# Altium schematic sheet 02_8MPLUS_PMIC.SchDoc: 8MPLUS_PMIC
size 420 x 297 mm; Author: Lukas Henkel; DocumentNumber: 2; SheetNumber: 2; SheetTotal: 16; DocSize: A3
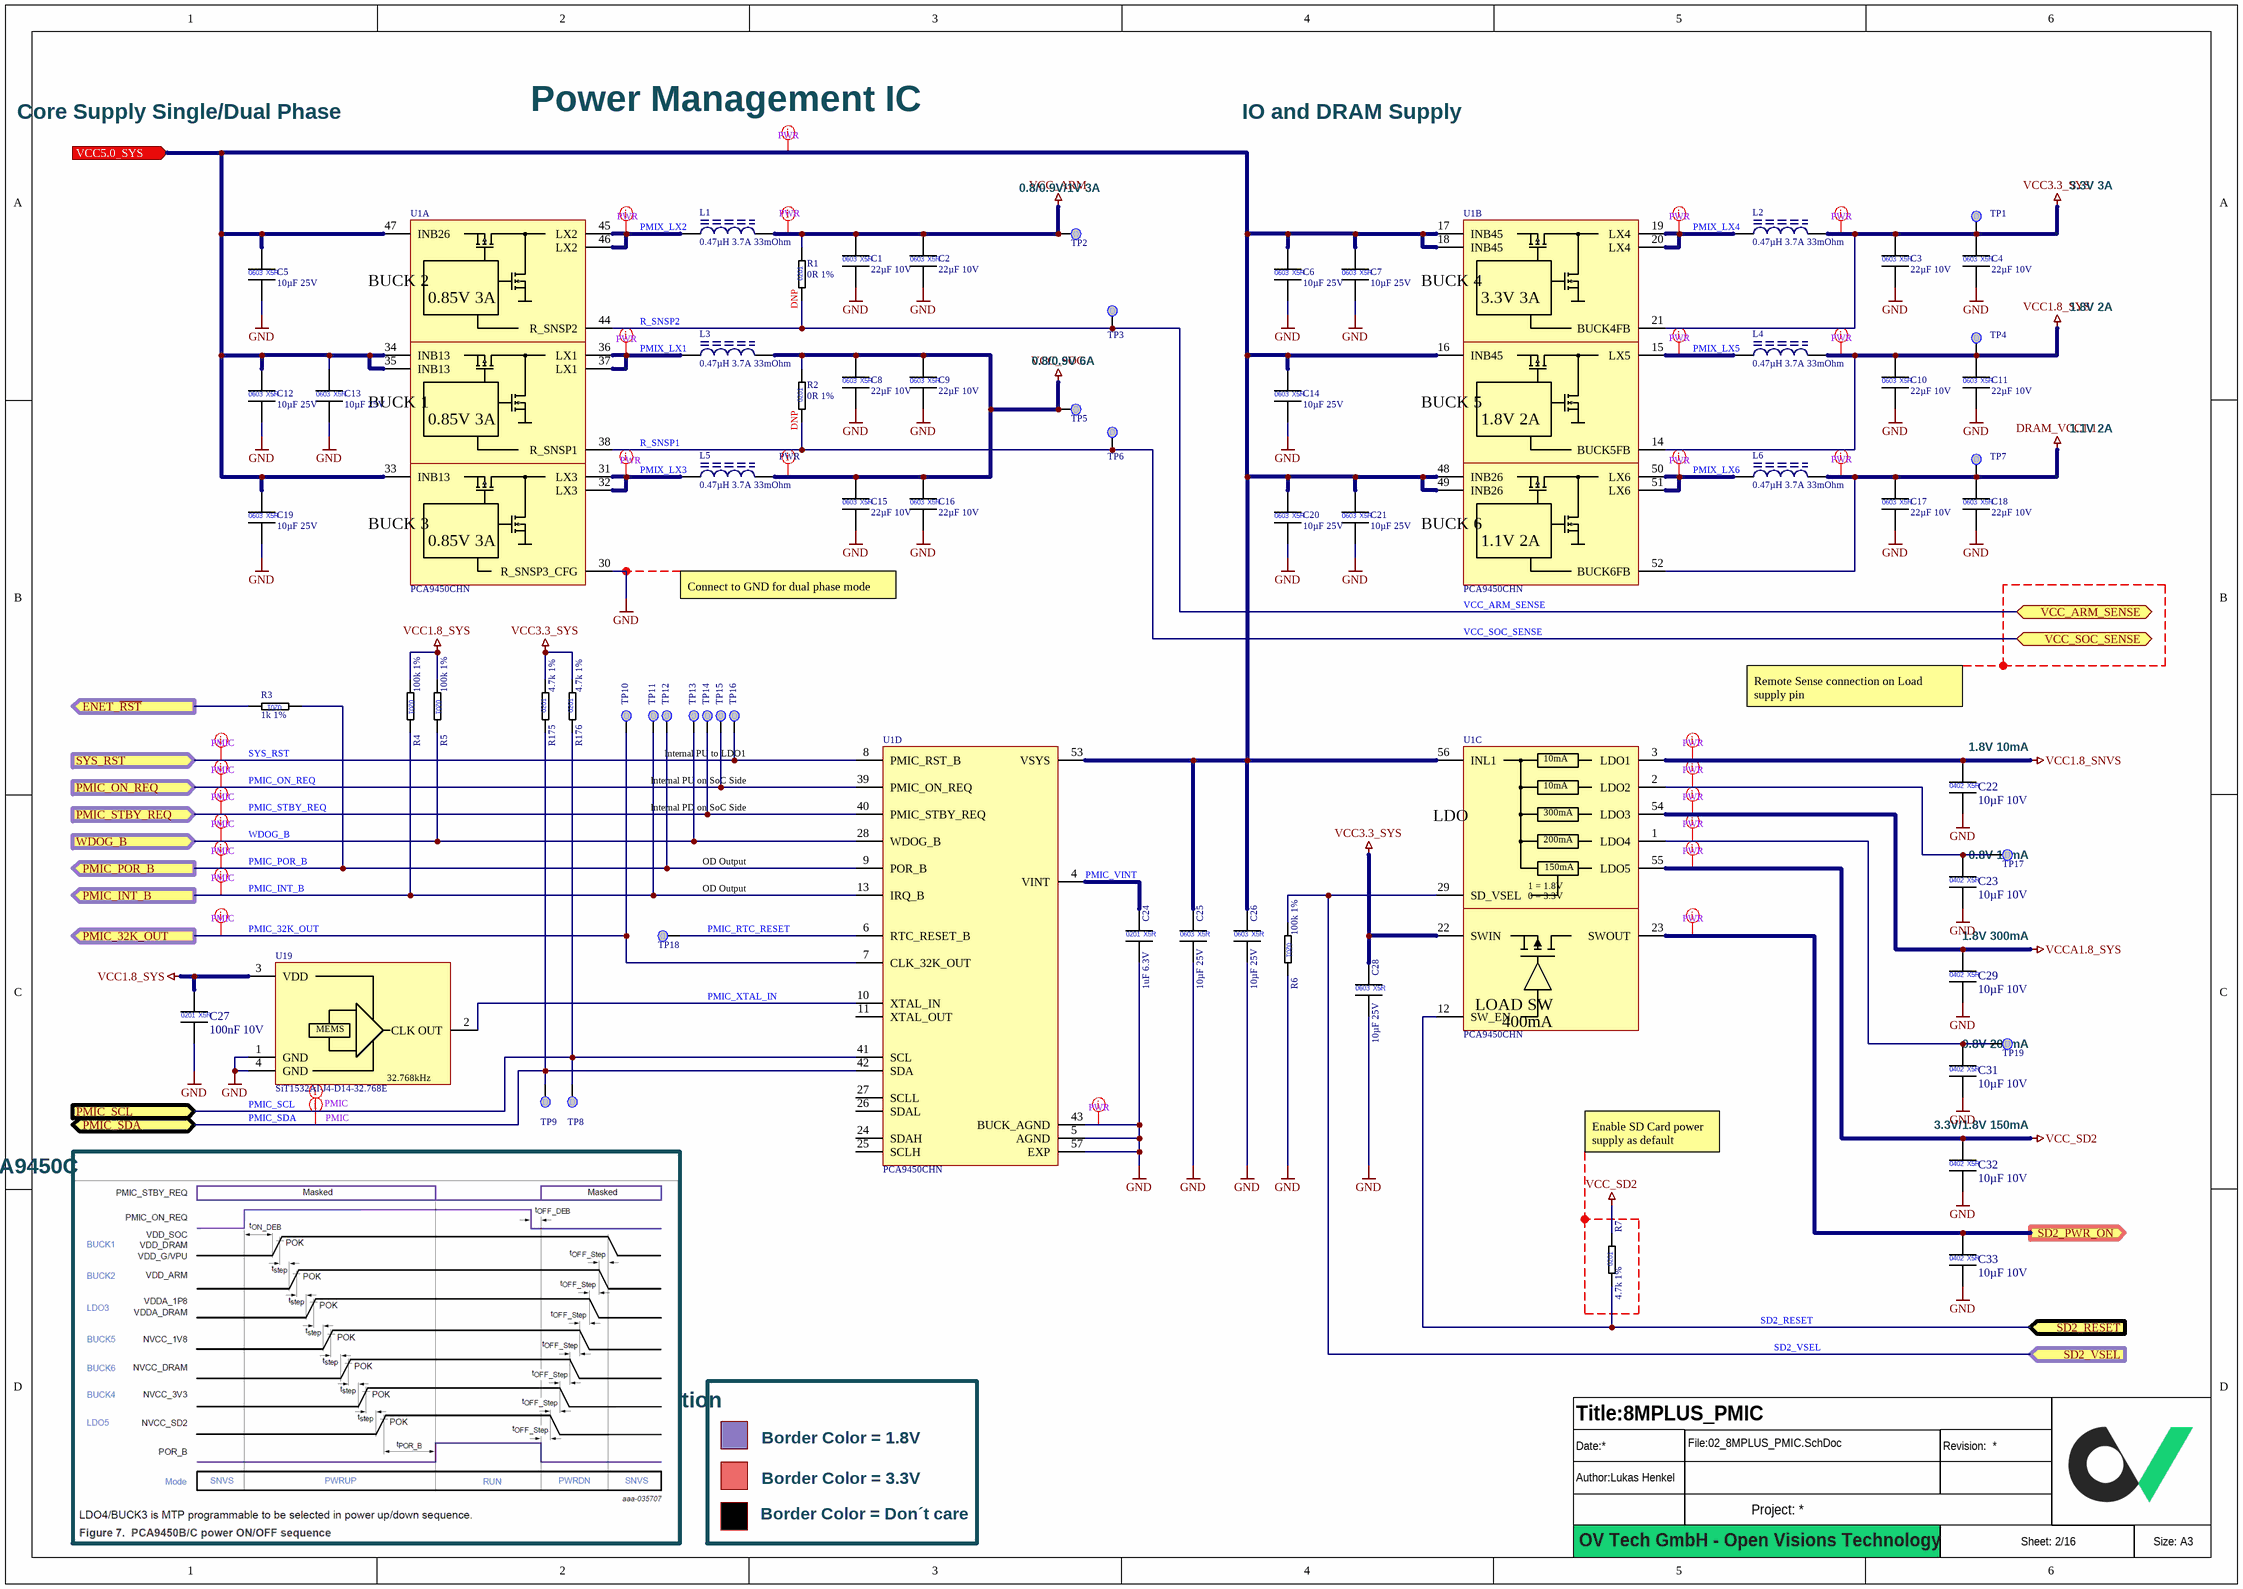
[diagram p0: 02_8MPLUS_PMIC.SchDoc]

## Parts
?  (no value)  (graphical)
C1  22µF 10V  [CAPC1608X10L]
C2  22µF 10V  [CAPC1608X10L]
C3  22µF 10V  [CAPC1608X10L]
C4  22µF 10V  [CAPC1608X10L]
C5  10µF 25V  [CAPC1608X10L]
C6  10µF 25V  [CAPC1608X10L]
C7  10µF 25V  [CAPC1608X10L]
C8  22µF 10V  [CAPC1608X10L]
C9  22µF 10V  [CAPC1608X10L]
C10  22µF 10V  [CAPC1608X10L]
C11  22µF 10V  [CAPC1608X10L]
C12  10µF 25V  [CAPC1608X10L]
C13  10µF 25V  [CAPC1608X10L]
C14  10µF 25V  [CAPC1608X10L]
C15  22µF 10V  [CAPC1608X10L]
C16  22µF 10V  [CAPC1608X10L]
C17  22µF 10V  [CAPC1608X10L]
C18  22µF 10V  [CAPC1608X10L]
C19  10µF 25V  [CAPC1608X10L]
C20  10µF 25V  [CAPC1608X10L]
C21  10µF 25V  [CAPC1608X10L]
C22  10µF 10V  [CAPC1005X06L]
C23  10µF 10V  [CAPC1005X06L]
C24  1uF 6.3V  [CAPC0603X03L]
C25  10µF 25V  [CAPC1608X10L]
C26  10µF 25V  [CAPC1608X10L]
C27  100nF 10V  [CAPC0603X03L]
C28  10µF 25V  [CAPC1608X10L]
C29  10µF 10V  [CAPC1005X06L]
C31  10µF 10V  [CAPC1005X06L]
C32  10µF 10V  [CAPC1005X06L]
C33  10µF 10V  [CAPC1005X06L]
L1  0.47µH 3.7A 33mOhm  [INDC2016X12L]
L2  0.47µH 3.7A 33mOhm  [INDC2016X12L]
L3  0.47µH 3.7A 33mOhm  [INDC2016X12L]
L4  0.47µH 3.7A 33mOhm  [INDC2016X12L]
L5  0.47µH 3.7A 33mOhm  [INDC2016X12L]
L6  0.47µH 3.7A 33mOhm  [INDC2016X12L]
R1  0R 1%  [RESC0603X03L]
R2  0R 1%  [RESC0603X03L]
R3  1k 1%  [RESC0603X03L]
R4  100k 1%  [RESC0603X03L]
R5  100k 1%  [RESC0603X03L]
R6  100k 1%  [RESC0603X03L]
R7  4.7k 1%  [RESC0603X03L]
R175  4.7k 1%  [RESC0603X03L]
R176  4.7k 1%  [RESC0603X03L]
TP1  Testpoint 0.5mm  [TP_0.50mm]  (value not drawn)  (no BOM)
TP2  Testpoint 0.5mm  [TP_0.50mm]  (value not drawn)  (no BOM)
TP3  Testpoint 0.5mm  [TP_0.50mm]  (value not drawn)  (no BOM)
TP4  Testpoint 0.5mm  [TP_0.50mm]  (value not drawn)  (no BOM)
TP5  Testpoint 0.5mm  [TP_0.50mm]  (value not drawn)  (no BOM)
TP6  Testpoint 0.5mm  [TP_0.50mm]  (value not drawn)  (no BOM)
TP7  Testpoint 0.5mm  [TP_0.50mm]  (value not drawn)  (no BOM)
TP8  Testpoint 0.5mm  [TP_0.50mm]  (value not drawn)  (no BOM)
TP9  Testpoint 0.5mm  [TP_0.50mm]  (value not drawn)  (no BOM)
TP10  Testpoint 0.5mm  [TP_0.50mm]  (value not drawn)  (no BOM)
TP11  Testpoint 0.5mm  [TP_0.50mm]  (value not drawn)  (no BOM)
TP12  Testpoint 0.5mm  [TP_0.50mm]  (value not drawn)  (no BOM)
TP13  Testpoint 0.5mm  [TP_0.50mm]  (value not drawn)  (no BOM)
TP14  Testpoint 0.5mm  [TP_0.50mm]  (value not drawn)  (no BOM)
TP15  Testpoint 0.5mm  [TP_0.50mm]  (value not drawn)  (no BOM)
TP16  Testpoint 0.5mm  [TP_0.50mm]  (value not drawn)  (no BOM)
TP17  Testpoint 0.5mm  [TP_0.50mm]  (value not drawn)  (no BOM)
TP18  Testpoint 0.5mm  [TP_0.50mm]  (value not drawn)  (no BOM)
TP19  Testpoint 0.5mm  [TP_0.50mm]  (value not drawn)  (no BOM)
U1  PCA9450CHN  [QFN40P700X700X100_HS-57L]  (parts A,B,C,D of 4)
U19  SiT1532AI-J4-D14-32.768E  [OSCILLATOR_SITIME_SiT1532AI-J4-D14-32.768E]

## Ports
ENET_~{RST} (out), PMIC_32K_OUT (out), PMIC_INT_B (out), PMIC_ON_REQ (in), PMIC_POR_B (out), PMIC_SCL (in), PMIC_SDA (bidir), PMIC_STBY_REQ (in), SD2_PWR_ON (out), SD2_RESET (in), SD2_VSEL (in), SYS_RST (in), VCC5.0_SYS (in), VCC_ARM_SENSE (bidir), VCC_SOC_SENSE (bidir), WDOG_B (in)

## Nets
DRAM_VCC1.1: C17.1 C18.1 L6.2 TP7.TP U1.52(BUCK6FB)
GND: C1.2 C2.2 C3.2 C4.2 C5.2 C6.2 C7.2 C8.2 C9.2 C10.2 C11.2 C12.2 C13.2 C14.2 C15.2 C16.2 C17.2 C18.2 C19.2 C20.2 C21.2 C22.2 C23.2 C24.2 C25.2 C26.2 C27.2 C28.2 C29.2 C31.2 C32.2 C33.2 R6.2 U1.5(AGND) U1.30(R_SNSP3_CFG) U1.43(BUCK_AGND) U1.57(EXP) U19.1(GND) U19.4(GND)
VCC1.8_SNVS: C22.1 U1.3(LDO1)
VCC1.8_SYS: C10.1 C11.1 C27.1 L4.2 R4.1 R5.1 TP4.TP U1.14(BUCK5FB) U19.3(VDD)
VCC3.3_SYS: C3.1 C4.1 C28.1 L2.2 R175.2 R176.2 TP1.TP U1.21(BUCK4FB) U1.22(SWIN)
VCC_ARM: C1.1 C2.1 L1.2 R1.2 TP2.TP
VCC_SD2: C32.1 R7.2 U1.55(LDO5)
VCC_SOC: C8.1 C9.1 C15.1 C16.1 L3.2 L5.2 R2.2 TP5.TP
VCCA1.8_SYS: C29.1 U1.54(LDO3)
ENET_~{RST}: R3.2 ; port ENET_~{RST}
PMIC_32K_OUT: TP10.TP U1.7(CLK_32K_OUT) ; port PMIC_32K_OUT
PMIC_INT_B: R4.2 TP11.TP U1.13(IRQ_B) ; port PMIC_INT_B
PMIC_ON_REQ: TP15.TP U1.39(PMIC_ON_REQ) ; port PMIC_ON_REQ
PMIC_POR_B: R3.1 TP12.TP U1.9(POR_B) ; port PMIC_POR_B
PMIC_RTC_RESET: TP18.TP U1.6(RTC_RESET_B)
PMIC_SCL: R176.1 TP8.TP U1.41(SCL) ; port PMIC_SCL
PMIC_SDA: R175.1 TP9.TP U1.42(SDA) ; port PMIC_SDA
PMIC_STBY_REQ: TP14.TP U1.40(PMIC_STBY_REQ) ; port PMIC_STBY_REQ
PMIC_VINT: C24.1 U1.4(VINT)
PMIC_XTAL_IN: U1.10(XTAL_IN) U19.2(CLK_OUT)
PMIX_LX1: L3.1 U1.36(LX1) U1.37(LX1)
PMIX_LX2: L1.1 U1.45(LX2) U1.46(LX2)
PMIX_LX3: L5.1 U1.31(LX3) U1.32(LX3)
PMIX_LX4: L2.1 U1.19(LX4) U1.20(LX4)
PMIX_LX5: L4.1 U1.15(LX5)
PMIX_LX6: L6.1 U1.50(LX6) U1.51(LX6)
R_SNSP1: R2.1 TP6.TP U1.38(R_SNSP1) ; port VCC_SOC_SENSE  [also labelled VCC_SOC_SENSE]
R_SNSP2: R1.1 TP3.TP U1.44(R_SNSP2) ; port VCC_ARM_SENSE  [also labelled VCC_ARM_SENSE]
SD2_PWR_ON: C33.1 U1.23(SWOUT) ; port SD2_PWR_ON
SD2_RESET: R7.1 U1.12(SW_EN) ; port SD2_RESET
SD2_VSEL: R6.1 U1.29(SD_VSEL) ; port SD2_VSEL
SYS_RST: TP16.TP U1.8(PMIC_RST_B) ; port SYS_RST
VCC5.0_SYS: C5.1 C6.1 C7.1 C12.1 C13.1 C14.1 C19.1 C20.1 C21.1 C25.1 C26.1 U1.16(INB45) U1.17(INB45) U1.18(INB45) U1.33(INB13) U1.34(INB13) U1.35(INB13) U1.47(INB26) U1.48(INB26) U1.49(INB26) U1.53(VSYS) U1.56(INL1) ; port VCC5.0_SYS
WDOG_B: R5.2 TP13.TP U1.28(WDOG_B) ; port WDOG_B
NetC23_1: C23.1 TP17.TP U1.2(LDO2)
NetC31_1: C31.1 TP19.TP U1.1(LDO4)

Not connected (* = marked no-connect by the designer): U1 11(XTAL_OUT) 24(SDAH) 25(SCLH) 26(SDAL) 27(SCLL)

## Layout directives
net class PWR: DRAM_VCC1.1, GND, NetC23_1, NetC31_1, PMIX_LX1, PMIX_LX2, PMIX_LX3, PMIX_LX4, PMIX_LX5, PMIX_LX6, SD2_PWR_ON, VCC1.8_SNVS, VCC1.8_SYS, VCC3.3_SYS, VCC5.0_SYS, VCC_ARM, VCC_SD2, VCC_SOC, VCCA1.8_SYS
net class PMIC: PMIC_32K_OUT, PMIC_INT_B, PMIC_ON_REQ, PMIC_POR_B, PMIC_SCL, PMIC_SDA, PMIC_STBY_REQ, SYS_RST, WDOG_B

## Notes on the sheet
- Core Supply Single/Dual Phase
- Power Management IC
- IO and DRAM Supply
- (near TP2) 0.8/0.9V/1V 3A
- 3.3V 3A
- (near R1) DNP
- 1.8V 2A
- 0.8/0.9V 6A
- (near R2) DNP
- 1.1V 2A
- Connect to GND for dual phase mode
- Remote Sense connection on Load supply pin
- Internal PU to LDO1
- (near U1) Internal PU on SoC Side
- 1.8V 10mA
- (near U1) Internal PD on SoC Side
- OD Output
- (near TP17) 0.8V 10mA
- 1.8V 300mA
- (near TP19) 0.8V 200mA
- 3.3V/1.8V 150mA
- Power Sequencing PCA9450C
- Enable SD Card power supply as default
- Signal Level Indication
- Border Color = 1.8V
- Border Color = Don´t care
- Border Color = 3.3V
- OV Tech GmbH - Open Visions Technology
- (in symbol CAP_0201_1uF_6.3V) 0201; X5R
- (in symbol CAP_0201_100nF_10V) 0201; X5R
- (in symbol CAP_0402_10µ_10V) 0402; X5R
- (in symbol CAP_0603_10µ_25V) 0603; X5R
- (in symbol CAP_0603_22µ_10V) 0603; X5R
- (in symbol MEMS Oscillator_SiTime_SiT1532AI-J4-D14-32.768E) MEMS; 32.768kHz
- (in symbol PMIC 6A 5.5V_PCA9450CHN, part A) BUCK 2; 0.85V 3A; BUCK 1; BUCK 3
- (in symbol PMIC 6A 5.5V_PCA9450CHN, part B) BUCK 4; 3.3V 3A; BUCK 5; 1.8V 2A; BUCK 6; 1.1V 2A
- (in symbol PMIC 6A 5.5V_PCA9450CHN, part C) 10mA; LDO; 300mA; 200mA; 150mA; 1 = 1.8V; 0 = 3.3V; LOAD SW; 400mA
- (in symbol RES_0201_0R_1%) 0201
- (in symbol RES_0201_1k_1%) 0201
- (in symbol RES_0201_4.7k_1%) 0201
- (in symbol RES_0201_100k_1%) 0201

## Library data of the parts
? = Titleblock_01_OpenSource
C1-C4 C8-C11 C15-C18 = CAP_0603_22µ_10V: Multilayer Ceramic Capacitors MLCC - SMD/SMT 0603 10VDC; Manufacturer 1: Murata Electronics; Manufacturer 1 Prt. Nr.: GRM188R61A226ME15D; Manufacturer 2 Prt. Nr.: CL10A226MP8NRNC; Manufacturer 2: Samsung Electro-Mechanics
C5-C7 C12-C14 C19-C21 C25 C26 C28 = CAP_0603_10µ_25V: Multilayer Ceramic Capacitors MLCC - SMD/SMT 0603 25VDC; Manufacturer 1: Murata Electronics; Manufacturer 1 Prt. Nr.: GRM188R61E106KA73J; Manufacturer 2 Prt. Nr.: CL10A106MA8NRNC; Manufacturer 2: Samsung Electro-Mechanics
C22 C23 C29 C31-C33 = CAP_0402_10µ_10V: Multilayer Ceramic Capacitors MLCC - SMD/SMT 0402 10VDC; Manufacturer 1: Murata Electronics; Manufacturer 1 Prt. Nr.: GRM155R61A106ME11D; Manufacturer 2 Prt. Nr.: 0402ZD106MAT4A; Manufacturer 2: KYOCERA AVX
C24 = CAP_0201_1uF_6.3V: Multilayer Ceramic Capacitors MLCC - SMD/SMT 0201 6.3VDC; Manufacturer 1: Murata Electronics; Manufacturer 1 Prt. Nr.: GRM033R60J105MEA2D; Manufacturer 2 Prt. Nr.: CL03A105MQ3CSNC; Manufacturer 2: Samsung Electro-Mechanics
C27 = CAP_0201_100nF_10V: Multilayer Ceramic Capacitors MLCC - SMD/SMT 0201 10VDC; Manufacturer 1: Murata Electronics; Manufacturer 1 Prt. Nr.: GRT033R61A104KE01J; Manufacturer 2 Prt. Nr.: CL03A104MP3NNNC; Manufacturer 2: Samsung Electro-Mechanics
L1-L6 = IND_DFE-P 2016_0.47µH_3.7A: Fixed Inductors DFE-P 2016 0.47uH 3.7A 20% 33mOhms HiCur; Manufacturer 1 Prt. Nr.: DFE201612P-R47M=P2; Manufacturer 1: Murata Electronics
R1 R2 = RES_0201_0R_1%: Thick Film Resistors - SMD 0R OHM 1%; Manufacturer 1: Yageo; Manufacturer 1 Prt. Nr.: RC0201FR-070RL; Manufacturer 2 Prt. Nr.: CRCW02010000Z0ED; Manufacturer 2: Vishay / Dale
R3 = RES_0201_1k_1%: Thick Film Resistors - SMD 1K OHM 1%; Manufacturer 1: Yageo; Manufacturer 1 Prt. Nr.: RC0201FR-071KL; Manufacturer 2 Prt. Nr.: CRCW02011K00FNED; Manufacturer 2: Vishay / Dale
R4-R6 = RES_0201_100k_1%: Thick Film Resistors - SMD 100K OHM 1%; Manufacturer 1: Yageo; Manufacturer 1 Prt. Nr.: RC0201FR-07100KL; Manufacturer 2 Prt. Nr.: CRCW0201100KFNED; Manufacturer 2: Vishay / Dale
R7 R175 R176 = RES_0201_4.7k_1%: Thick Film Resistors - SMD 4.7K OHM 1%; Manufacturer 1: Yageo; Manufacturer 1 Prt. Nr.: RC0201JR-074K7P; Manufacturer 2 Prt. Nr.: CRCW02014K70FNED; Manufacturer 2: Vishay / Dale
U1 = PMIC 6A 5.5V_PCA9450CHN: 5.5V, 6A, Low I Q ,Synchronous Buck Converter PMIC; Manufacturer 1: NXP Semiconductors; Manufacturer 1 Prt. Nr.: PCA9450CHN
U19 = MEMS Oscillator_SiTime_SiT1532AI-J4-D14-32.768E: 10 ppm Ultra-Low Power 32.768 kHz XTAL Replacement; Manufacturer 1: SiTime; Manufacturer 1 Prt. Nr.: SiT1532AI-J4-D14-32.768E